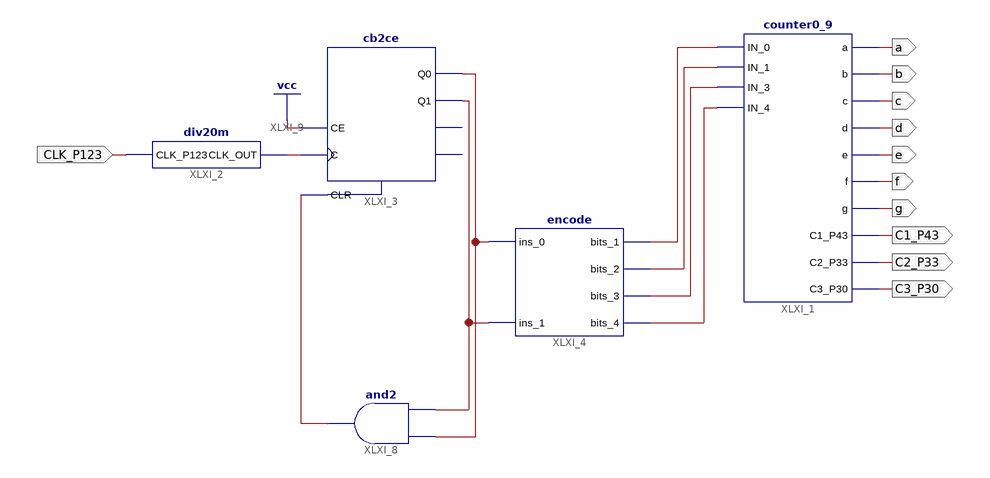
[diagram p0: schematic sheet 1]
// Xilinx ISE schematic counter5_2.sch (spartan6) as structural Verilog: 5 symbols, 11 ports
module counter5_2 (
  input  CLK_P123,
  output a,
  output b,
  output c,
  output d,
  output e,
  output f,
  output g,
  output C1_P43,
  output C2_P33,
  output C3_P30
);

  wire IN_0, IN_1, IN_3, IN_4, XLXN_4, XLXN_5, XLXN_24, XLXN_25;

  div20m XLXI_2 (.CLK_P123(CLK_P123), .CLK_OUT(XLXN_24));
  counter0_9 XLXI_1 (
    .a(a), .b(b), .c(c), .d(d), .e(e), .f(f), .g(g), .C1_P43(C1_P43), .C2_P33(C2_P33), .C3_P30(C3_P30),
    .IN_0(IN_0), .IN_1(IN_1), .IN_3(IN_3), .IN_4(IN_4));
  encode XLXI_4 (.ins_0(XLXN_4), .ins_1(XLXN_5), .bits_1(IN_0), .bits_2(IN_1), .bits_3(IN_3), .bits_4(IN_4));
  cb2ce XLXI_3 (.C(XLXN_24), .CE(1'b1), .CLR(XLXN_25), .Q0(XLXN_4), .Q1(XLXN_5));  // open: CEO, TC
  and XLXI_8 (XLXN_25, XLXN_5, XLXN_4);
endmodule
